# Altium project KSG_REFLOW_0825.PrjPcb
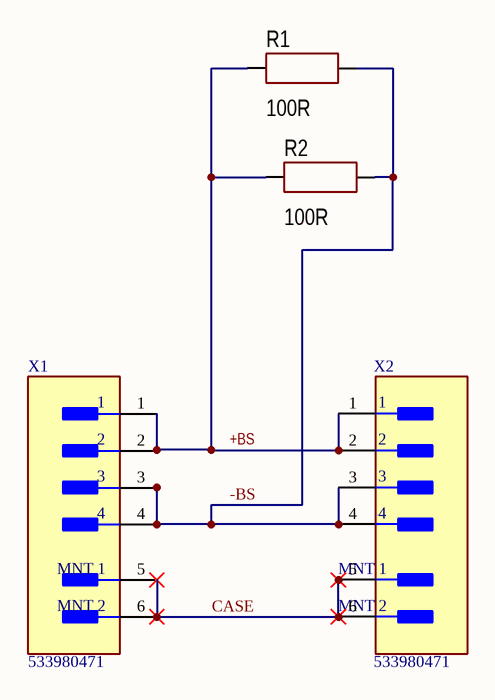
[diagram p0: main.SchDoc]
1 sheet, 4 parts. Net scope: global (net labels, ports and power ports of the same name join across sheets).
Board files: KSG_REFLOW_0825_BOARD_ksv.PcbDoc, KSG_REFLOW_0825_BOARD.PcbDoc

## Sheet main.SchDoc
size A3; SheetNumber: 1; SheetTotal: 1

### Parts
R1  value 100R  [RES: 0805]
R2  value 100R  [RES: 0805]
X1  533980471  [FP-533980471-MFG]
X2  533980471  [FP-533980471-MFG]

### Nets
-BS: R1.2 R2.2 X1.3 X1.4 X2.3 X2.4
CASE: X1.5(MNT_1) X1.6(MNT_2) X2.5(MNT_1) X2.6(MNT_2)
NetR1_1: R1.1 R2.1 X1.1 X1.2 X2.1 X2.2

### Notes on the sheet
- Labels drawn without touching a wire or pin: +BS

### Library data of the parts
R1 R2 = Resistor_0805: Manufacturer: Yageo; PartNumber: RC0805JR-07100RL; TypeResistor: Resistor film; Power: 0.125W; Package: 0805; HelpURL: https://www.digikey.com/product-detail/en/yageo/RC0805JR-07100RL/311-100ARCT-ND/731185; ValueManufacturerPartNumber: =TypeResistor+', '+Value+', '+Tolerance+', '+Package+', '+Power+', '+Temperature; Temperature: -55...+125°C
X1 X2 = CMP-04776-000105-1: CONN HEADER SMD 4POS 1.25MM; Manufacturer: Molex; Conn Gender: Male; Conn Orientation: Vertical; Standoff Height: 0.05mm; Number Of Contacts: 4; Current Rating: 1A; Voltage Rating: 125V; Package: 0; ComponentLink2Description: Datasheet; ComponentLink2URL: https://www.molex.com/pdm_docs/ps/PS-51021-024-001.pdf; Ambient Temperature Range Low: -40°C; Category: Conn; Automotive: No; Number Of Rows: 1; Device Class L3: unset; Ambient Temperature Range High: +105°C; Height: 5.1mm; Lead Free: Yes; Pitch: 1.25mm; Contact Material: Tin; Footprint Url: https://www.molex.com/pdm_docs/sd/533980471_sd.pdf; Octopart: https://octopart.com/53398-0471-molex-655296; Temperature Range Low: -40°C; Device Class L2: Headers and Wire Housings; Temperature: -40°C to +105°C; Digikey Description: CONN HEADER SMD 4POS 1.25MM; RoHS: TRUE; Manufacturer Part Number: 533980471; Device Class L1: Connectors; Temperature Range High: +105°C